# Altium schematic sheet SAM4N_Xplained_Pro_Crystals.SchDoc: Power supply
size A3; Organization: ATMEL Norway; Address1: Vestre Rosten 79; Address2: N-7075 TILLER; Address3: NORWAY; DocumentNumber: A09-1967; Revision: 2; SheetNumber: 6; SheetTotal: 6; PageSetup: Record=PageOptions|CenterHorizontal=True|CenterVertical=True|PrintScale=1.01|XCorrection=1.00|YCorrection=1.00|PrintKind=1|BorderSize=5000000|LeftOffset=0|BottomOffset=0|Orientation=2|PaperLength=1000|PaperWidth=1000|Scale=100|PaperSource=7|PrintQuality=-4|MediaType=1|DitherType=10|PaperKind=A3 (297 x 420 mm)|PrintScaleMode=1
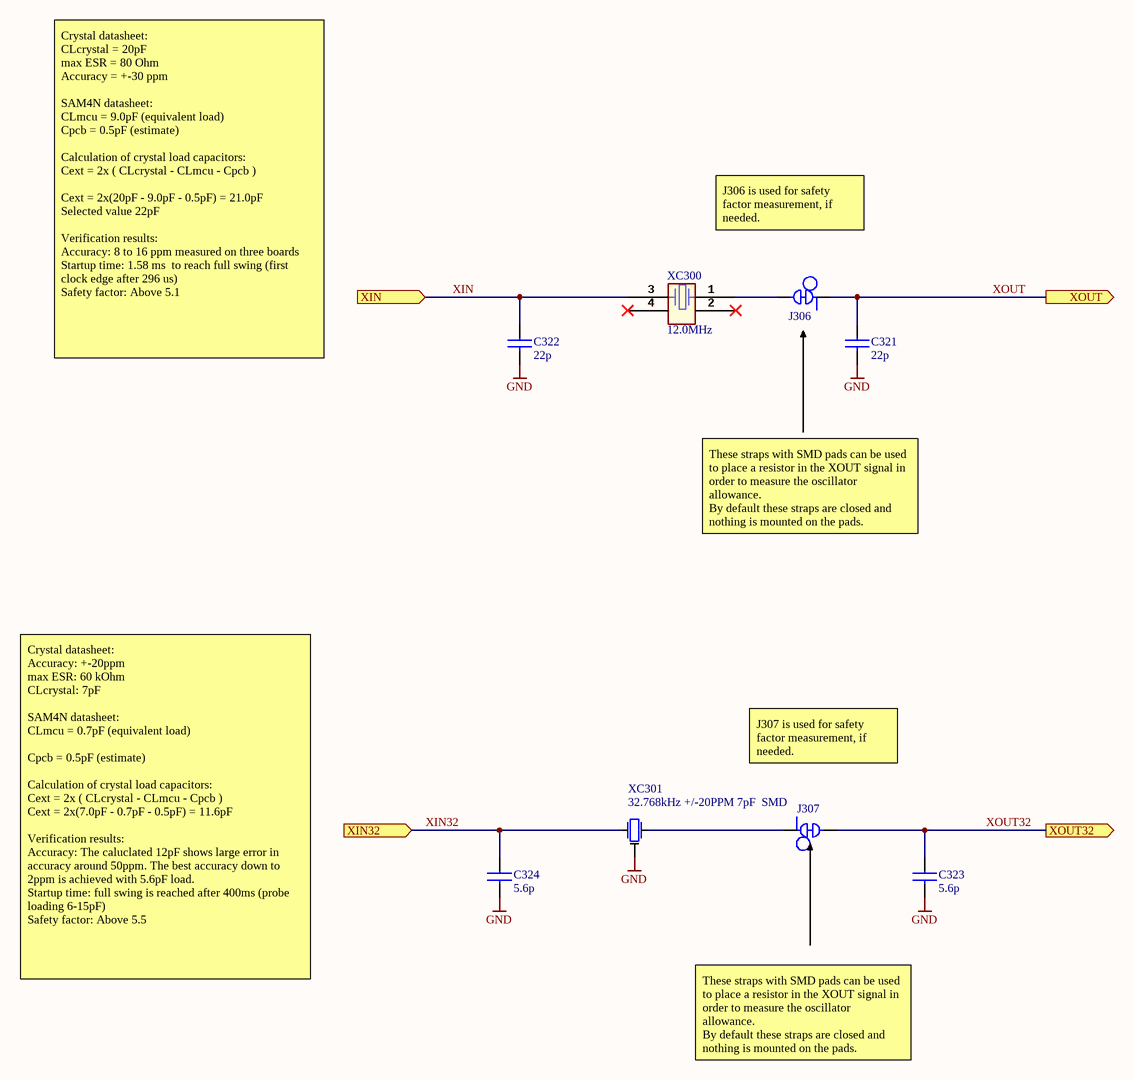
[diagram p0: SAM4N_Xplained_Pro_Crystals.SchDoc]

## Parts
C321  value 22p  [AP1-00001]  (hidden comment: CAP-NONPOL)
C322  value 22p  [AP1-00001]  (hidden comment: CAP-NONPOL)
C323  value 5.6p  [AP1-00001]  (hidden comment: CAP-NONPOL)
C324  value 5.6p  [AP1-00001]  (hidden comment: CAP-NONPOL)
J306  SMD-STRAP_CLOSED  [AP9-00044]  (value not drawn)  (net tie, no BOM)
J307  SMD-STRAP_CLOSED  [AP9-00044]  (value not drawn)  (net tie, no BOM)
XC300  12.0MHz  [AP7-00039]
XC301  value 32.768kHz +/-20PPM 7pF  SMD  [AP7-00044]  (hidden comment: Farnell order no:1539364)

## Ports
XIN32 (in), XIN (in), XOUT32 (out), XOUT (out)

## Nets
GND: C321.2 C322.2 C323.2 C324.2 XC301.3
XIN: C322.1 XC300.3 ; port XIN
XIN32: C324.1 XC301.2 ; port XIN32
XOUT: C321.1 J306.1 ; port XOUT
XOUT32: C323.1 J307.2 ; port XOUT32
NetJ306_2: J306.2 XC300.1
NetJ307_1: J307.1 XC301.1

Not connected (* = marked no-connect by the designer): XC300 2* 4*

## Notes on the sheet
- J306 is used for safety factor measurement, if needed.
- Crystal datasheet:
  CLcrystal = 20pF
  max ESR = 80 Ohm
  Accuracy = +-30 ppm
  SAM4N datasheet:
  CLmcu = 9.0pF (equivalent load)
  Cpcb = 0.5pF (estimate)
  Calculation of crystal load capacitors:
  Cext = 2x ( CLcrystal - CLmcu - Cpcb )
  Cext = 2x(20pF - 9.0pF - 0.5pF) = 21.0pF
  Selected value 22pF
  Verification results:
  Accuracy: 8 to 16 ppm measured on three boards
  Startup time: 1.58 ms  to reach full swing (first clock edge after 296 us)
  Safety factor: Above 5.1
- These straps with SMD pads can be used to place a resistor in the XOUT signal in order to measure the oscillator allowance.
  By default these straps are closed and nothing is mounted on the pads.
- J307 is used for safety factor measurement, if needed.
- Crystal datasheet:
  Accuracy: +-20ppm
  max ESR: 60 kOhm
  CLcrystal: 7pF
  SAM4N datasheet:
  CLmcu = 0.7pF (equivalent load)
  Cpcb = 0.5pF (estimate)
  Calculation of crystal load capacitors:
  Cext = 2x ( CLcrystal - CLmcu - Cpcb )
  Cext = 2x(7.0pF - 0.7pF - 0.5pF) = 11.6pF
  Verification results:
  Accuracy: The caluclated 12pF shows large error in accuracy around 50ppm. The best accuracy down to 2ppm is achieved with 5.6pF load.
  Startup time: full swing is reached after 400ms (probe loading 6-15pF)
  Safety factor: Above 5.5
- Date:
- PAGE:
- of
- TITLE:
- Document number:
- Revision:

## Library data of the parts
C321 C322 = A01-0019: Ceramic capacitor, SMD 0402, NP0, 50V, +/-5%; PartGroup: Capacitors,Ceramic,SMD 0402; TemperatureRange: -55 - +125 deg C; AN: A01-0019; Tolerance: 50V, +/-5%; Height: 0.550000011920929
C323 C324 = A01-0012: Ceramic capacitor, SMD 0402, NP0, 50V, +/-5%; PartGroup: Capacitors,Ceramic,SMD 0402; TemperatureRange: -55 - +125 deg C; AN: A01-0012; Tolerance: 50V, +/-5%; Height: 0.550000011920929
J306 J307 = A09-0783: Default closed SMD strap, 0603 size; PartGroup: Mechanical devices,PCB implemented components; Value: SMD-STRAP_0603_CLOSED; AN: A09-0783; Height: 0
XC300 = A07-0042: Fox FQ5032B 12.0MHz SMD crystal 738B-12; PartGroup: Frequency devices,Crystals,SMD; Manufacturer: Fox  Electronics; MPN: FQ5032B-12-C-C-C-200-1; Tolerance: 30PPM; AN: A07-0042; Value: 12.0MHz; Height: 1,20000004768372
XC301 = A07-0052: 32k768 crystal, +-20ppm, CL=7pF, max ESR 60kOhm, SMD; PartGroup: Frequency devices,Crystals,SMD; Manufacturer: Micro Crystal; MPN: MS1V-T1K 32.768kHz 7pF +/-20PPM TA; Tolerance: +/- 20 PPM; TemperatureRange: -40 /+85; AN: A07-0052; Height: 2,07999992370605